# EAGLE design flasher_without_opto (EAGLE 7.7.0)
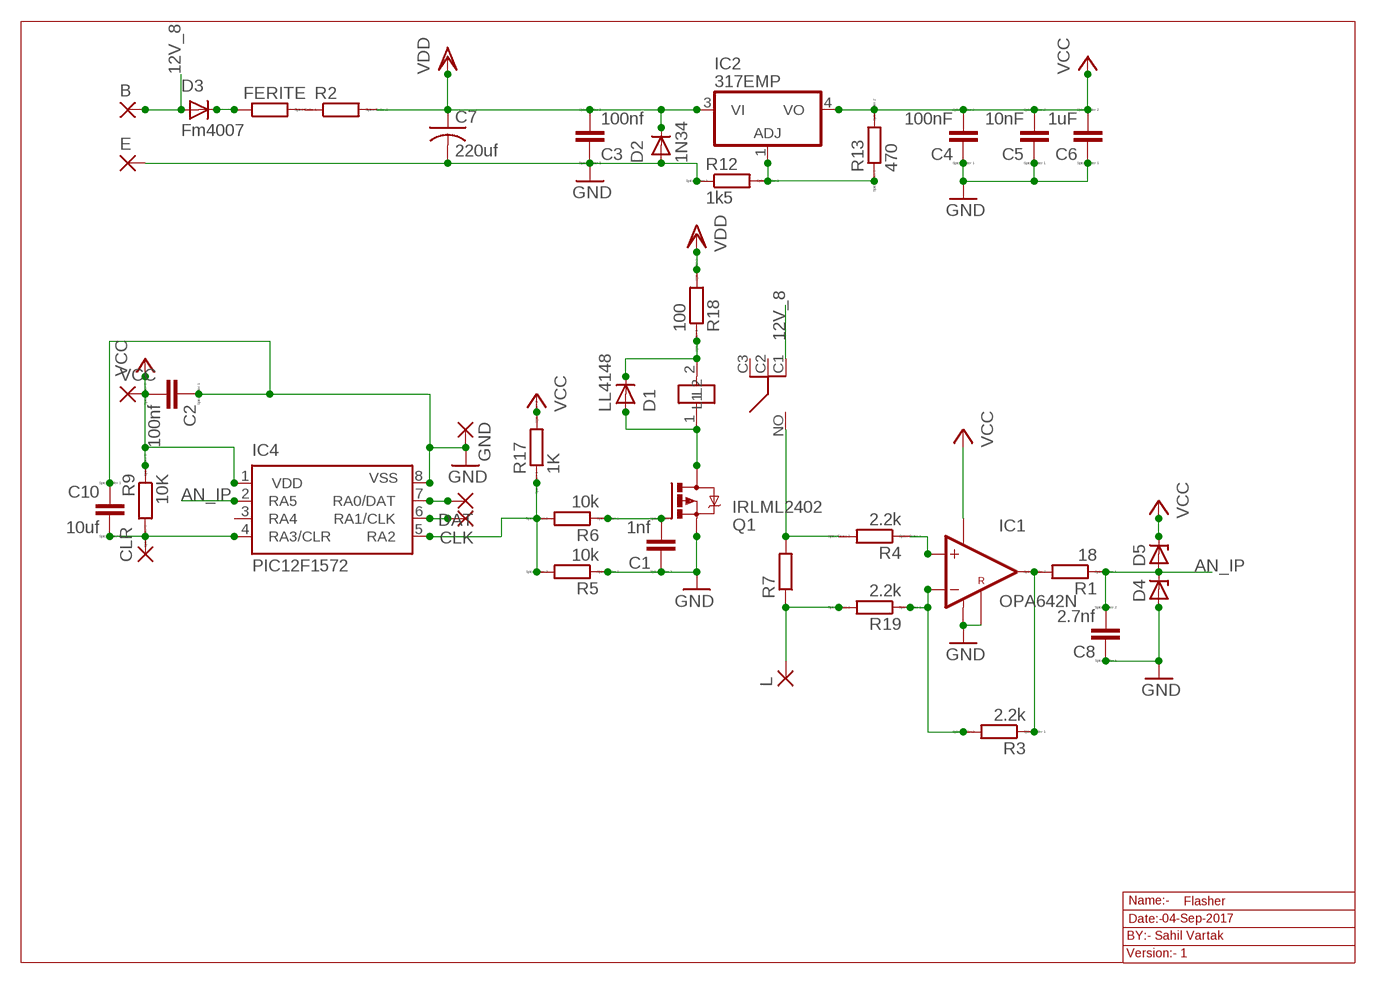
[diagram p0: schematic, sheet 1]

## Parts
B  2,54/1,1  [2,54/1,1]
C1  1nf  CC0603  [C0603]
C2  100nf  CC0603  [C0603]
C3  100nf  CC0603  [C0603]
C4  100nF  CC0603  [C0603]
C5  10nF  CC0603  [C0603]
C6  1uF  CC0603  [C0603]
C7  220uf  C-US025-025X050  [C025-025X050]
C8  2.7nf  CC0603  [C0603]
C10  10uf  CC0603  [C0603]
CLK  1,6/0,8  [1,6/0,8]
CLR  1,6/0,8  [1,6/0,8]
D1  LL4148  GF1  [SMA-DO214AC]
D2  1N34  GF1  [SMA-DO214AC]
D3  Fm4007  GF1  [SMA-DO214AC]
D4  ZENER-DIODESOD80C  [SOD80C]
D5  ZENER-DIODESOD80C  [SOD80C]
DAT  1,6/0,8  [1,6/0,8]
E  2,54/1,1  [2,54/1,1]
FERITE  R-EU_R0603  [R0603]
GND  1,6/0,8  [1,6/0,8]
IC1  OPA642N  [INA181]
IC2  317EMP  [SOT223]
IC4  PIC12F1572  PIC12F675SN  [SO-08]
K2  RL703  [RL703]
L  2,54/1,1  [2,54/1,1]
Q1  IRLML2402  IRLML5203  [MICRO3]
R1  18  RR0603  [R0603]
R2  RR5025  [R5025]
R3  2.2k  RR0603  [R0603]
R4  2.2k  RR0603  [R0603]
R5  10k  RR0603  [R0603]
R6  10k  RR0603  [R0603]
R7  R-EU_0207/15  [0207/15]
R9  10K  RR0603  [R0603]
R12  1k5  RR0603  [R0603]
R13  470  RR0603  [R0603]
R17  1K  RR0603  [R0603]
R18  100  RR0603  [R0603]
R19  2.2k  RR0603  [R0603]
VCC  1,6/0,8  [1,6/0,8]

## Nets
12V_8: B.1(P) D3.A K2.C1
AN_IP: C8.2 D4.C D5.A IC4.2(RA5) R1.1
GND: C1.1 C2.1 C3.1 C4.1 C5.1 C6.1 C7.2 C8.1 C10.1 D2.A D4.A E.1(P) GND.1(P) IC1.P$2(V-) IC1.P$5(REF) IC4.8(VSS) Q1.2(S) R5.1 R12.1
N$1: FERITE.2 R2.1
N$3: IC4.5(RA2) R5.2 R6.2 R17.1
N$5: D1.A K2.1(L2) Q1.3(D)
N$7: D3.K(C) FERITE.1
N$8: DAT.1(P) IC4.7(RA0/DAT)
N$9: CLK.1(P) IC4.6(RA1/CLK)
N$13: D1.K(C) K2.2(L1) R18.1
N$14: IC2.1(ADJ) R12.2 R13.1
N$16: K2.NO R4.2 R7.2
N$19: L.1(P) R7.1 R19.2
N$21: IC1.P$4(-IN) R3.2 R19.1
N$22: IC1.P$3(+IN) R4.1
N$23: IC1.P$1(OUT) R1.2 R3.1
N$72: C1.2 Q1.1(G) R6.1
N$87: C10.2 CLR.1(P) IC4.4(RA3/CLR) R9.2
VCC: C2.2 C4.2 C5.2 C6.2 D5.C IC1.P$6(V+) IC2.4(VO) IC4.1(VDD) R9.1 R13.2 R17.2 VCC.1(P)
VDD: C3.2 C7.1 D2.K(C) IC2.3(VI) R2.2 R18.2
Unconnected: IC4.3(RA4) K2.C2 K2.C3

## Notes on the sheet
- Name:- | Flasher
- Date:- | 04-Sep-2017
- BY:- Sahil Vartak
- Version:- 1

## Library data of the parts
B E L = wirepad:2,54/1,1: THROUGH-HOLE PAD
C1-C6 C8 C10 = eagle-ltspice:C: CAPACITOR, European symbol; SPICEMODEL: NONE; SPICEPREFIX: C
C7 = rcl:C-US: CAPACITOR, American symbol
CLK CLR DAT GND VCC = wirepad:1,6/0,8: THROUGH-HOLE PAD
D1-D3 = diode:GF1: DIODE
D4 D5 = diode:ZENER-DIODE: Z-Diode
FERITE R7 = resistor:R-EU_: RESISTOR, European symbol
IC1 = burr-brown:OPA642N: Operational Amplifier Wideband, Low Distortion
IC2 = lm317:*317: Positive VOLTAGE REGULATOR
IC4 = microchip:PIC12F6*: Data Sheet 8-Pin FLASH-Based 8-Bit CMOS Microcontrollers Source: http://www.microchip.com .. 41190c.pdf; MF: MICROCHIP; MPN: PIC12F675-E/SN; OC_FARNELL: 9759026; OC_NEWARK: 92C4341
K2 = relay:RL703
Q1 = transistor-power:IRLML5203: HEXFET P-Channel Power MOSFET
R1-R6 R9 R12 R13 R17-R19 = eagle-ltspice:R: RESISTOR, European symbol; SPICEMODEL: NONE; SPICEPREFIX: R

## Board
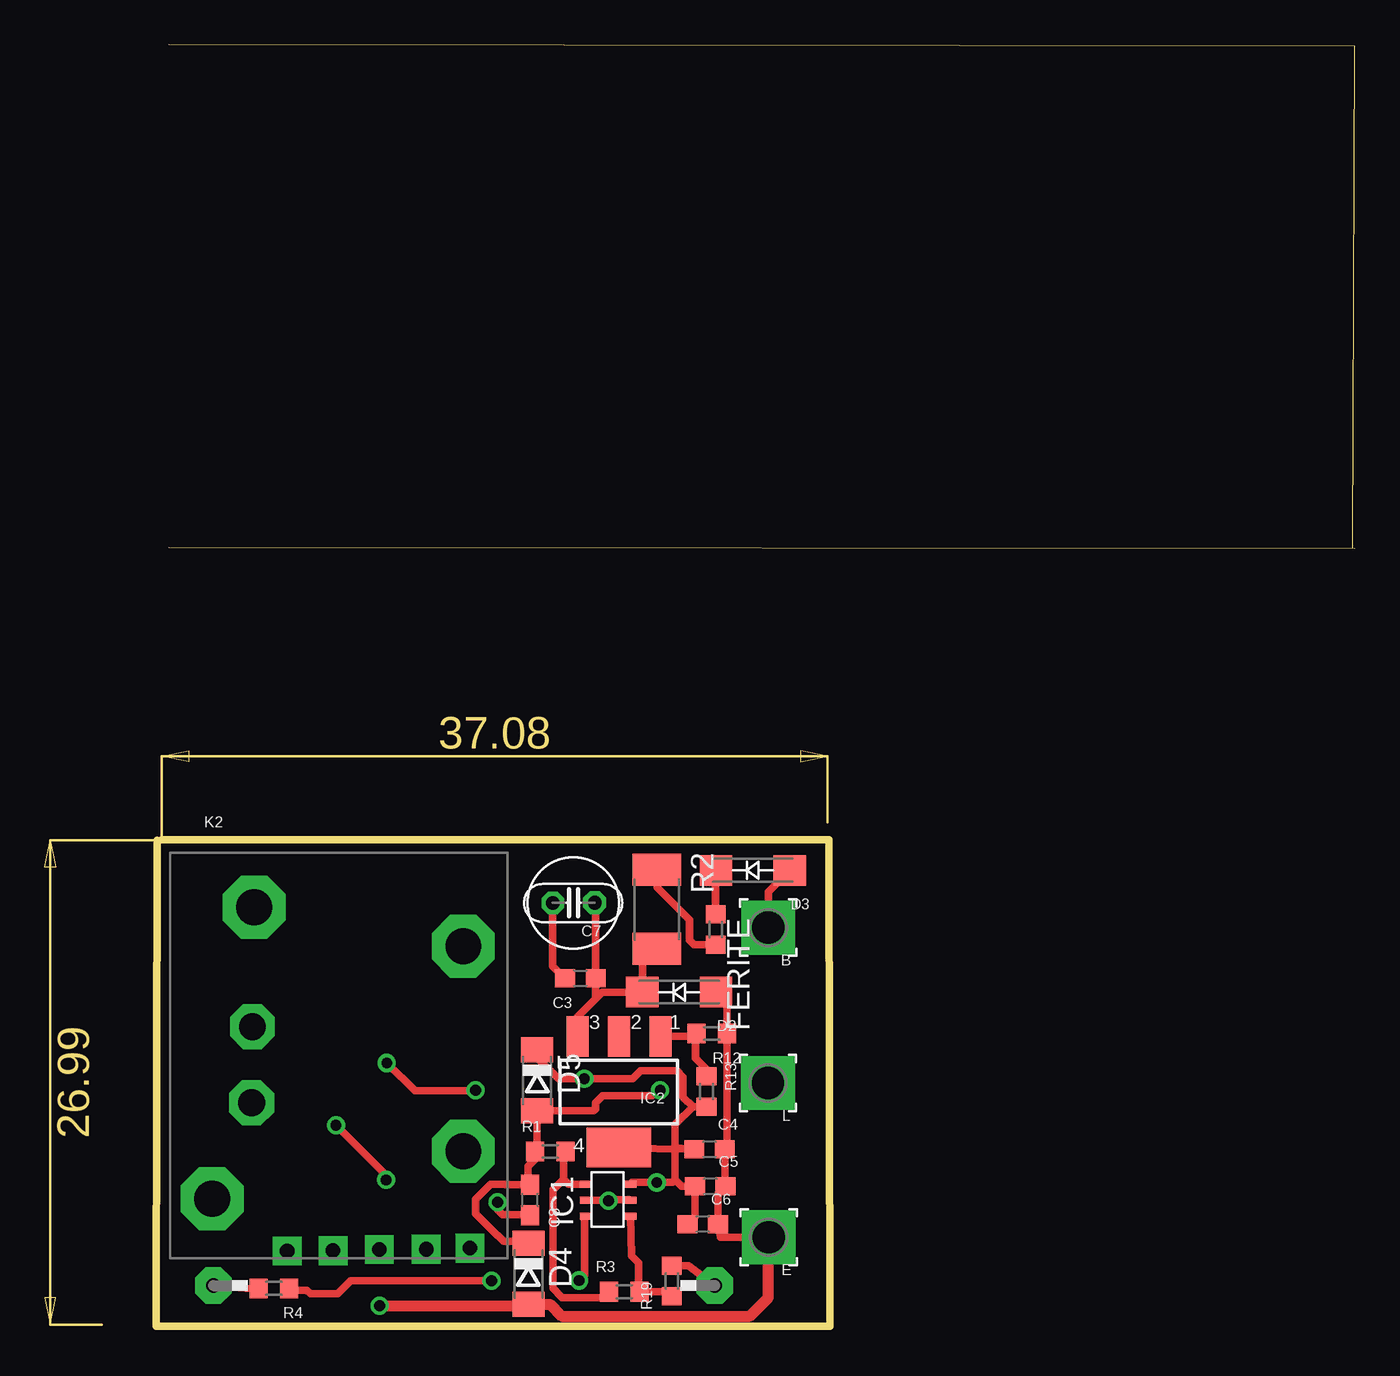
[diagram p1: board, top side]
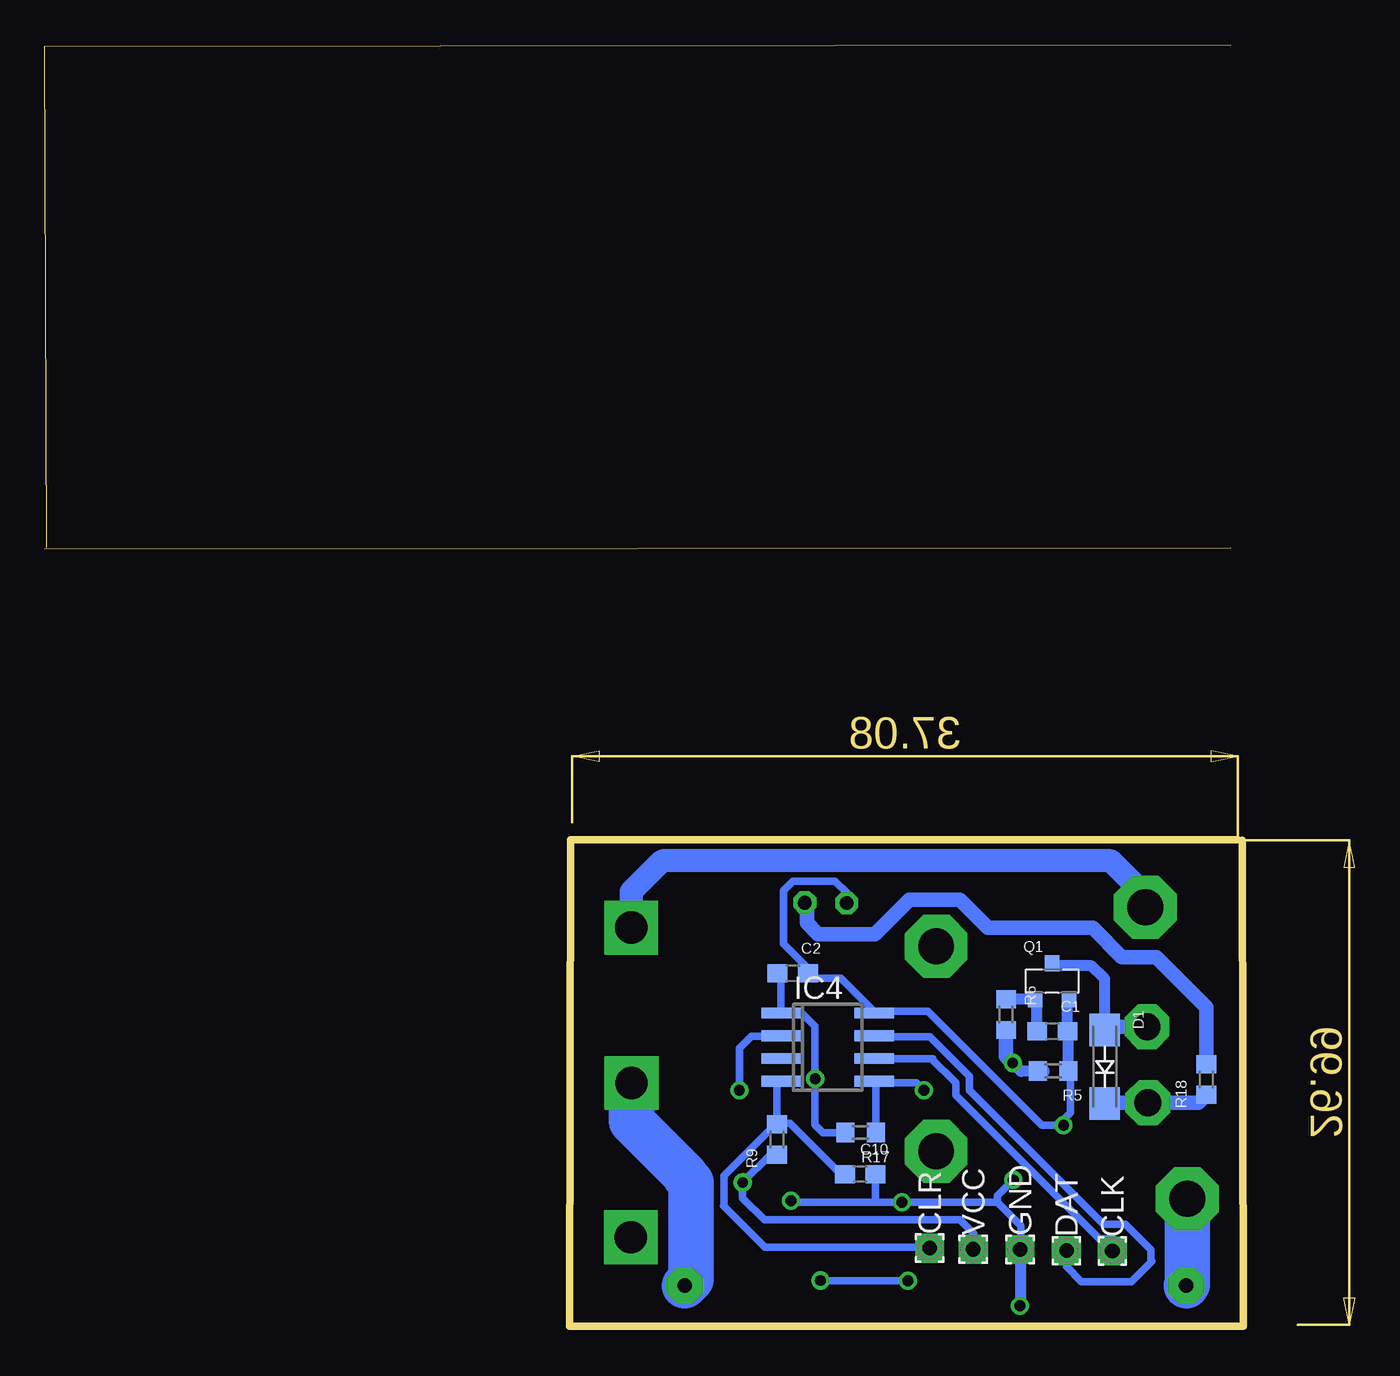
[diagram p2: board, bottom side, seen from below]

Size 66.78 x 71.39 mm. Coordinates in mm from the lower left corner, seen from the top.
Outline: 0.68,71.39 66.78,71.33 66.68,43.38
Outline: 66.78,43.32 0.68,43.38
Outline: 0.31,27.11 37.47,27.11 37.54,0 0,0 0.04,27.09
Copper layers (1*16): Top 0.035mm / dielectric 1.5mm / Bottom 0.035mm
Design rules "default": minimum track width 10mil, minimum drill 24mil, track to track 8mil, track to pad 8mil, pad to pad 8mil, via to via 8mil, smd to smd 8mil, copper to edge 40mil, drill to drill 8mil, minimum pad ring 10mil, minimum via ring 8mil, stop-mask expansion 4mil, vias tented up to drill 0mil, thermal gap 10mil

### Footprints (pad centres in the part's own frame; a part is rotated, then mirrored left to right if it is on the bottom)
2,54/1,1 = drill 1.8 pad 3 square: 1 0,0
C0603 = smd 1.1 x 1: 1 -0.85,0; 2 0.85,0
C025-025X050 = drill 0.762 pad 1.27 octagon: 1 -1.176,-0.006; 2 1.159,0.007
1,6/0,8 = drill 0.813 pad 1.6 square: 1 0,0
SMA-DO214AC = smd 1.8 x 1.7: A -2.05,0; K 2.05,0
SOD80C = smd 1.4 x 1.8: A 1.7,0; C -1.7,0
R0603 = smd 1 x 1.1: 1 -0.85,0; 2 0.85,0
INA181 = smd 0.4 x 0.7: P$1 -0.86,-1.23; P$2 0.04,-1.23; P$3 0.94,-1.23; P$4 0.94,1.24; P$5 0.04,1.24; P$6 -0.86,1.24
SOT223 = smd 1.219 x 2.235: 1 -2.311,-3.099; 2 0,-3.099; 3 2.311,-3.099 | smd 3.6 x 2.2: 4 0,3.099
SO-08 = smd 0.6 x 2.2: 1 -1.905,-2.6; 2 -0.635,-2.6; 3 0.635,-2.6; 4 1.905,-2.6; 5 1.905,2.6; 6 0.635,2.6; 7 -0.635,2.6; 8 -1.905,2.6
RL703 = drill 1.5 pad 2.5 octagon: 1 1.73,-5.643; 2 -2.51,-5.693 | drill 2 pad 3.5 octagon: C1 8.38,-5.543; C2 6.2,6.107; C3 -5.21,6.107; NO -7.86,-7.883
MICRO3 = smd 0.8 x 0.9: 1 -0.95,-1; 2 0.95,-1; 3 0,1
R5025 = smd 1.8 x 2.7: 1 -2.2,0; 2 2.2,0
0207/15 = drill 0.813 pad 2.032 octagon: 1 -13.97,0; 2 13.97,0

### Placement (x,y rotation side)
B  34.1,22.22 180 top
C1  10.64,16.43 180 bottom
C2  25.11,19.67 180 bottom
C3  23.63,19.38 0 top
C4  30.83,9.87 180 top
C5  30.87,7.8 180 top
C6  30.45,5.69 180 top
C7  23.25,23.6 180 top
C8  20.83,7.05 90 top
C10  21.34,8.48 180 bottom
CLK  7.29,4.2 0 bottom
CLR  17.47,4.36 0 bottom
D1  7.72,14.46 270 bottom
D2  29.14,18.63 180 top
D3  33.24,25.41 180 top
D4  20.74,2.93 270 top
D5  21.22,13.71 270 top
DAT  9.85,4.22 0 bottom
E  34.13,4.97 180 top
FERITE  31.17,22.11 270 top
GND  12.43,4.29 0 bottom
IC1  25.18,7.07 270 top
IC2  25.78,13.06 180 top
IC4  23.15,15.56 270 bottom
K2  11,14.97 90 bottom
L  34.09,13.56 180 top
Q1  10.65,19.23 0 bottom
R1  21.96,9.74 0 top
R2  27.89,23.24 270 top
R3  26.08,1.93 0 top
R4  6.55,2.12 180 top
R5  10.59,14.24 180 bottom
R6  13.22,17.36 270 bottom
R7  17.15,2.28 180 top
R9  25.98,10.42 90 bottom
R12  30.96,16.31 180 top
R13  30.66,13.09 270 top
R17  21.32,10.8 180 bottom
R18  2.06,13.75 90 bottom
R19  28.72,2.52 90 top
VCC  15.04,4.3 0 bottom

### Tracks (layer width: path | path; a pad name or v marks a point on that pad's centre or on a via)
12V_8
  Top 0.406: B.1 34.1,24.22 D3.A
  Bottom 1.27: K2.C1 5.46,24.03 7.37,25.94 32.38,25.94 34.1,24.22 B.1
AN_IP  (via drill 0.6)
  Top 0.406: D4.C 20.62,4.75 19.34,4.75 19.01,5.08 19,5.08 17.79,6.29 17.79,7.08 18.62,7.91 19.44,7.91 19.45,7.9 C8.2 20.71,8.02 20.71,8.91 21.17,9.37 21.17,9.68 R1.1 21.22,9.85 D5.A 24.37,12.01 24.47,12.11 24.47,12.47 24.86,12.86 27.61,12.86 v28.08,13.15
  Bottom 0.406: v28.08,13.15 28.08,15.49 27.4,16.17 25.78,16.17 IC4.2
GND  (via drill 0.6)
  Top 0.406: E.1 31.43,4.97 C6.1 31.3,7.38 C5.1 31.68,7.84 C4.1 31.81,9.99 R12.1 31.81,18.01 D2.A | 20.83,6.24 C8.1 19.3,6.21 19.01,6.5 v19.01,6.92 | 34.1,4.94 E.1 | C7.2 22.09,20.08 C3.1 | 25.07,6.92 25.14,6.85 25.14,6.75 25.46,7.07 | 25.46,7.07 25.31,6.97 v25.2,7 25.17,7.03 IC1.P$2 | 34.16,4.94 E.1 | 10.01,10.96 v10.01,11.21 12.81,8.41 v12.81,8.16 | 25.46,7.07 26.38,7.07 IC1.P$5
  Top 0.61: v12.44,1.15 20.66,1.15 D4.A 21.93,1.23 22.59,0.57 33.08,0.57 34.11,1.6 34.11,4.95 E.1
  Bottom 0.406: v25.2,7 25.34,6.92 20.43,6.92 | 20.43,6.92 v19.01,6.92 13.7,6.92 | 13.7,6.92 12.4,5.62 12.4,4.32 | 13.7,6.92 13.7,7.27 v12.81,8.16 | C7.2 22.08,23.61 22.08,24.15 22.74,24.81 25.08,24.81 25.62,24.27 25.62,21.32 24.26,19.96 C2.1 23.97,19.39 22.41,19.39 20.55,17.53 IC4.8 20.46,17.56 17.56,17.56 11.21,11.21 v10.01,11.21 10.01,11.51 9.62,11.9 9.62,14.12 R5.1 | C10.1 20.49,6.98 20.43,6.92
  Bottom 0.61: Q1.2 9.79,18.14 C1.1 9.73,16.38 R5.1 | v12.44,1.15 v12.43,1.16 GND.1 12.4,4.32
N$1
  Top 0.406: R2.1 27.89,24.46 29.7,22.65 29.7,21.52 29.96,21.26 FERITE.2
N$3  (via drill 0.6)
  Top 0.406: v12.84,14.67 12.86,14.67 14.42,13.12 17.76,13.12 v17.79,13.15
  Bottom 0.406: R17.1 20.47,13.57 | 20.47,13.57 IC4.5 | 20.47,13.57 18.21,13.57 v17.79,13.15
  Bottom 0.61: 11.19,14.21 12.38,14.21 v12.84,14.67
  Bottom 0.813: 11.19,14.21 R5.2 | R6.2 13.22,15.05 v12.84,14.67
N$5
  Bottom 0.61: D1.A 7.71,19.36 8.45,20.09 10.5,20.09 Q1.3
  Bottom 0.813: K2.1 7.53,16.7 D1.A
N$7
  Top 0.406: FERITE.1 31.17,25.39 D3.K
N$8
  Bottom 0.406: DAT.1 9.85,3.34 9.01,2.5 6.22,2.5 5.1,3.62 5.14,3.66 5.14,4.27 6.57,5.7 7.8,5.7 15.25,13.15 15.25,13.94 17.45,16.14 20.5,16.14 IC4.7
N$9
  Bottom 0.406: IC4.6 17.37,14.92 | 17.37,14.92 17.29,14.92 | CLK.1 7.24,4.25 7.24,4.88 8.01,4.88 16.01,12.88 16.01,13.56 17.37,14.92
N$13
  Bottom 0.813: D1.K 7.67,12.46 K2.2 2.5,12.46 R18.1
N$14
  Top 0.406: IC2.1 29.95,16.15 R12.2 30.06,16.27 30.06,14.93 30.66,14.33 R13.1
N$16
  Top 0.406: R4.2 5.7,2.06 R7.2
  Bottom 2.54: K2.NO 3.12,2.34 R7.2
N$19
  Top 0.406: R19.2 29.66,3.37 R7.1
  Bottom 2.54: L.1 34.09,11.43 31.07,8.41 31.07,8.31 30.78,8.02 30.78,2.62 R7.1
N$21
  Top 0.406: IC1.P$4 26.49,3.94 26.87,3.56 26.87,1.82 R3.2 28.46,1.93 R19.1 28.62,1.77
N$22  (via drill 0.6)
  Top 0.406: 23.81,2.82 v23.55,2.56 23.87,2.88 23.87,6.05 IC1.P$3 | v18.68,2.55 10.84,2.55 10.1,1.81 8.59,1.81 8.38,2.02 7.4,2.02 R4.1
  Bottom 0.406: v18.68,2.55 v23.54,2.55 v23.55,2.56
N$23
  Top 0.406: 22.7,8.21 22.7,9.63 R1.2 | 24.95,1.6 R3.1 24.9,1.6 22.62,1.6 22.1,2.12 22.1,7.65 22.14,7.65 22.7,8.21 | IC1.P$1 22.98,7.93 22.7,8.21
N$72
  Bottom 0.61: R6.1 13.2,18.23 Q1.1 11.49,18.12 C1.2
N$87
  Bottom 0.406: CLR.1 17.52,4.41 26.64,4.41 28.96,6.73 28.93,6.76 28.93,8.4 26.06,11.27 R9.2 | C10.2 22.41,8.48 25.25,11.32 25.93,11.32 R9.2 | R9.2 25.98,13.43 IC4.4
VCC  (via drill 0.6)
  Top 0.406: R13.2 29.9,12.24 | 29.9,12.24 28.91,11.25 28.91,9.95 | 28.91,9.95 C4.2 25.78,9.92 IC2.4 25.91,10.09 | D5.C 21.22,14.98 21.87,14.33 21.88,14.33 22.41,13.8 v23.85,13.8 26.54,13.8 26.98,14.24 29.01,14.24 29.36,13.89 29.36,12.77 29.9,12.24 | C6.2 30.02,6.11 C5.2 29.27,7.8 28.91,8.16 | 28.91,9.95 28.91,8.16 | 28.91,8.16 28.77,8.02 v27.89,8.02 26.51,8.02 IC1.P$6
  Bottom 0.406: VCC.1 15.01,4.33 15.01,5.16 15.8,5.95 26.69,5.95 27.89,7.15 v27.89,8.02 26.34,9.57 R9.1 | R17.2 23.41,10.8 23.85,11.24 v23.85,13.8 23.85,16.71 24.54,17.4 25.69,17.4 IC4.1 25.75,19.47 C2.2
VDD
  Top 0.406: 27.19,20.34 R2.2 27.09,20.24 D2.K 24.85,18.63 24.48,18.26 | IC2.3 23.46,17.24 24.48,18.26 | 24.48,18.26 C3.2 24.48,23.55 C7.1
  Bottom 0.813: R18.2 2.06,17.79 4.85,20.58 6.75,20.58 8.38,22.21 14.23,22.21 15.78,23.76 18.61,23.76 20.51,21.86 23.69,21.86 24.31,22.48 24.31,23.49 C7.1